# Altium schematic sheet OpenBL-5C.SchDoc
size A
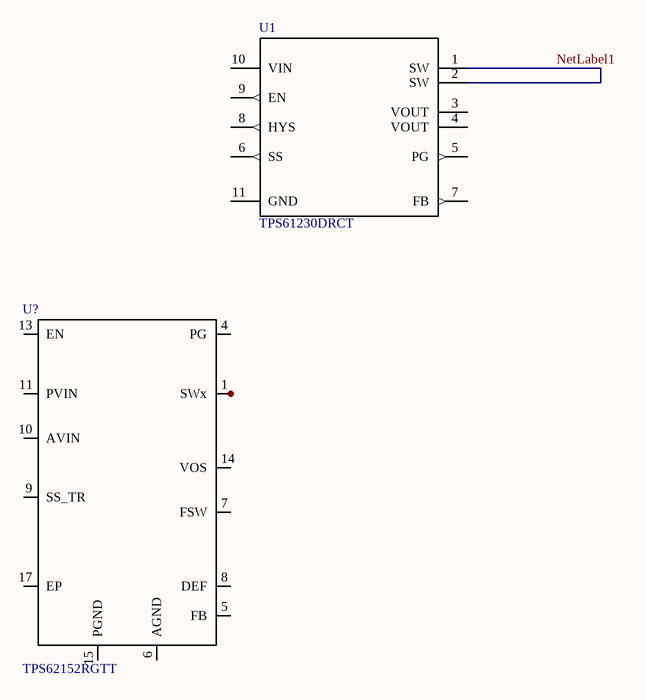
[diagram p0: OpenBL-5C.SchDoc]

## Parts
U1  TPS61230DRCT  [TPS61230DRCR]
U?  TPS62152RGTT  [TPS62152RGTR]

## Nets
NetLabel1: U1.1(SW) U1.2(SW)
NetU?_1: U?.1(SWx) U?.2(SW) U?.3(SW)
NetU?_11: U?.11(PVIN) U?.12(PVIN)
NetU?_15: U?.15(PGND) U?.16(PGND)

Not connected (* = marked no-connect by the designer): U1 3(VOUT) 4(VOUT) 5(PG) 6(SS) 7(FB) 8(HYS) 9(EN) 10(VIN) 11(GND); U? 4(PG) 5(FB) 6(AGND) 7(FSW) 8(DEF) 9(SS_TR) 10(AVIN) 13(EN) 14(VOS) 17(EP)

## Library data of the parts
U1 = TPS61230DRCT: Manufacturer: Texas Instruments; Description: Spanningsregelaars - Schakelende regelaars HE Sync Boost Converter; Ingangsspanning: 2.3 V to 5.5 V; Ingangsspanning MAX.: 5.5 V; Aantal uitgangen: 1 Output; Bedrijfstemperatuurbereik: - 40 C to + 85 C; Uitgangsstroom: 2.1 A; Uitgangspanning: 2.5 V to 5.5 V; Verpakking / doos: VSON-10; Verpakken: Reel; Montagetype: SMD/SMT; Uitschakeling: Shutdown; Schakelfrequentie: 2 MHz; Topologie: Boost; Ingangsspanning MIN: 2.3 V; Maximale bedrijfstemperatuur: + 85 C; Minimale bedrijfstemperatuur: - 40 C; Product Status: New Product; Supplier 1: Mouser; Supplier Part Number 1: 595-TPS61230DRCT; RoHS: RoHS Compliant; Category: Spanningsregelaars - Schakelende regelaars; Stock 1: 464; Pricing 1: 1=2.66, 10=2.38, 25=2.14, 50=2.04, 100=1.94, 250=1.75, 500=1.58, 750=1.42, 1000=1.38 (EUR); Reeks: TPS61230; Type: Step-Up Converter; Merk: Texas Instruments; Fabrikant: Texas Instruments; Voedingsspanning - Min: 2.3 V; RoHS - Mouser: Y; Minimum Order Quantity: 1; Reeling: True; ComponentLink1URL: http://www.mouser.com/ds/2/405/slvsaq2b-350046.pdf; ComponentLink1Description: http://www.mouser.com/ds/2/405/slvsaq2b-350046.pdf; Manufacturer Part Number: TPS61230DRCT
U? = TPS62152RGTT: Manufacturer: Texas Instruments; Output Type: Fixed; Number of Outputs: 1; Voltage - Output: 3.3V; Voltage - Input: 3 V ~ 17 V; Frequency - Switching: 2.5MHz; Current - Output: 1A; Synchronous Rectifier: Yes; Supplier 1: Digi-Key; RoHS: RoHS Compliant; Category: Integrated Circuits (ICs); Stock 1: 1028; Pricing 1: 1=2.99, 10=2.696, 25=2.4148, 100=2.1715 (USD); Packaging: Cut Tape (CT); Type: Step-Down (Buck); Operating Temperature: -40°C ~ 85°C; Mounting Type: Surface Mount; Package / Case: 16-VFQFN Exposed Pad; Supplier Device Package: 16-QFN (3x3); ComponentLink1URL: http://www.ti.com/lit/ds/symlink/tps62151.pdf; ComponentLink1Description: http://www.ti.com/lit/ds/symlink/tps62151.pdf; Supplier Part Number 1: 296-30009-1-ND